# Altium schematic sheet Power.SchDoc
size A
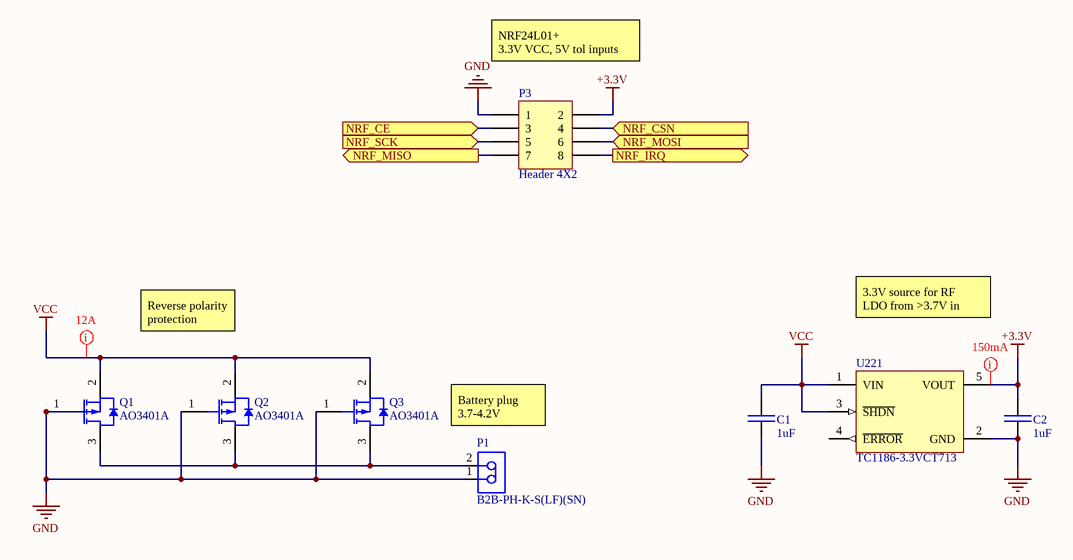
[diagram p0: Power.SchDoc]

## Parts
C1  1uF  [CAPC2012X14M]
C2  1uF  [CAPC2012X14M]
P1  B2B-PH-K-S(LF)(SN)  [JST-B2B-PH-K-S_V]
P3  Header 4X2  [HDR2X4]
Q1  AO3401A  [AO-SOT-23-3L_V]
Q2  AO3401A  [AO-SOT-23-3L_V]
Q3  AO3401A  [AO-SOT-23-3L_V]
U221  TC1186-3.3VCT713  [SOT-23-CT5_L]

## Ports
NRF_CE (in), NRF_CSN (in), NRF_IRQ (out), NRF_MISO (out), NRF_MOSI (in), NRF_SCK (in)

## Nets
+3.3V: C2.1 P3.2 U221.5(VOUT)
GND: C1.2 C2.2 P1.1 P3.1 Q1.1(GATE) Q2.1(GATE) Q3.1(GATE) U221.2(GND)
VCC: C1.1 Q1.2(SOURCE) Q2.2(SOURCE) Q3.2(SOURCE) U221.1(VIN) U221.3(~{SHDN})
NRF_CE: P3.3 ; port NRF_CE
NRF_CSN: P3.4 ; port NRF_CSN
NRF_IRQ: P3.8 ; port NRF_IRQ
NRF_MISO: P3.7 ; port NRF_MISO
NRF_MOSI: P3.6 ; port NRF_MOSI
NRF_SCK: P3.5 ; port NRF_SCK
NetP1_2: P1.2 Q1.3(DRAIN) Q2.3(DRAIN) Q3.3(DRAIN)

Not connected (* = marked no-connect by the designer): U221 4(~{ERROR})

## Layout directives
mark named 12A: VCC
mark named 150mA: +3.3V

## Notes on the sheet
- NRF24L01+
  3.3V VCC, 5V tol inputs
- Reverse polarity protection
- 3.3V source for RF
  LDO from >3.7V in
- (near P1) Battery plug
  3.7-4.2V

## Library data of the parts
C1 C2 = CL21B105KBFNNNE_1: MULTILAYER CERAMIC CAPACITORS MLCC - SMD/SMT 1UF 50V 0805 ROHS; Value: 1uF; LCSC Part #: C28323
P1 = CMP-2000-05162-1: Male Header, Pitch 2 mm, 1 x 2 Position, Height 6 mm, Tail Length 3.4 mm, -25 to 85 degC, RoHS, Bulk; Manufacturer: JST; Pitch: 2mm; Style/Orientation: StraightHeader/Plug; No of Positions: 2; Datasheet Version: Nov-08; Datasheet URL: http://datasheet.octopart.com/B2B-PH-K-S%28LF%29%28SN%29-JST-datasheet-8324864.pdf; Manufacturer URL: http://www.jst.com/home2.html; Type: ShroudedHeader; Termination: Crimp
P3 = Header 4X2: Header, 4-Pin, Dual row; LatestRevisionDate: 17-Jul-2002; LatestRevisionNote: Re-released for DXP Platform.; Publisher: Altium Limited
Q1-Q3 = CMP-2000-05778-1: P-Channel MOSFET, 30 V, 4 A, -55 to 150 degC, 3-Pin SOT-23-3L, RoHS, Tape and Reel; Manufacturer: Alpha and Omega; Output Power (Max): NotRequiredW; Power Dissipation: 1.4W; Rad Hardened: No; Drain Efficiency: NotRequired%; Drain-Source On-Volt: 30V; Noise Figure: NotRequireddB; Frequency (Max): NotRequiredMHz; Number of  Elements: 1; Gate-Source Voltage (Max): ?12V; Drain Current (Max): 4A; Channel Mode: Enhancement; Drain-Source On-Res: 0.044ohm; Type: PowerMOSFET; Polarity: P; Package URL: http://www.aosmd.com/res/packaging_information/SOT-23-3L.pdf; Datasheet URL: http://www.aosmd.com/res/data_sheets/AO3401A.pdf; Package Type: SOT-23; Package Description: 3-Pin Small Outline Transistor, Body 2.95 x 1.6 mm, Pitch 0.95 mm; Mounting: SurfaceMount; Manufacturer URL: http://www.aosmd.com/; Continuous Drain Current: 4A; Package Reference: SOT-23-3L; Mounting Technology: SurfaceMount; Operating Temperature Classification: Military; Power Gain: NotRequireddB; Datasheet Version: Rev. 3, 03/2011; Operating Temp Range: -55Cto150C; Pin Count: 3
U221 = CMP-0136-00555-1: 50 mA, 100 mA and 150 mA CMOS LDOs with Shutdown and Active-Low Error Output, 5-Pin SOT-23, Extended Temperature, Tape and Reel; PackageDescription: 5-Lead Plastic Small Outline Transistor (CT) [SOT-23]; DatasheetVersion: revD, Feb-2007; Code_IPC: SOT23-5; PackageVersion: revBB, Aug-2009; PackageReference: SOT-23-CT5